# Altium project PCB_Project.PrjPCB
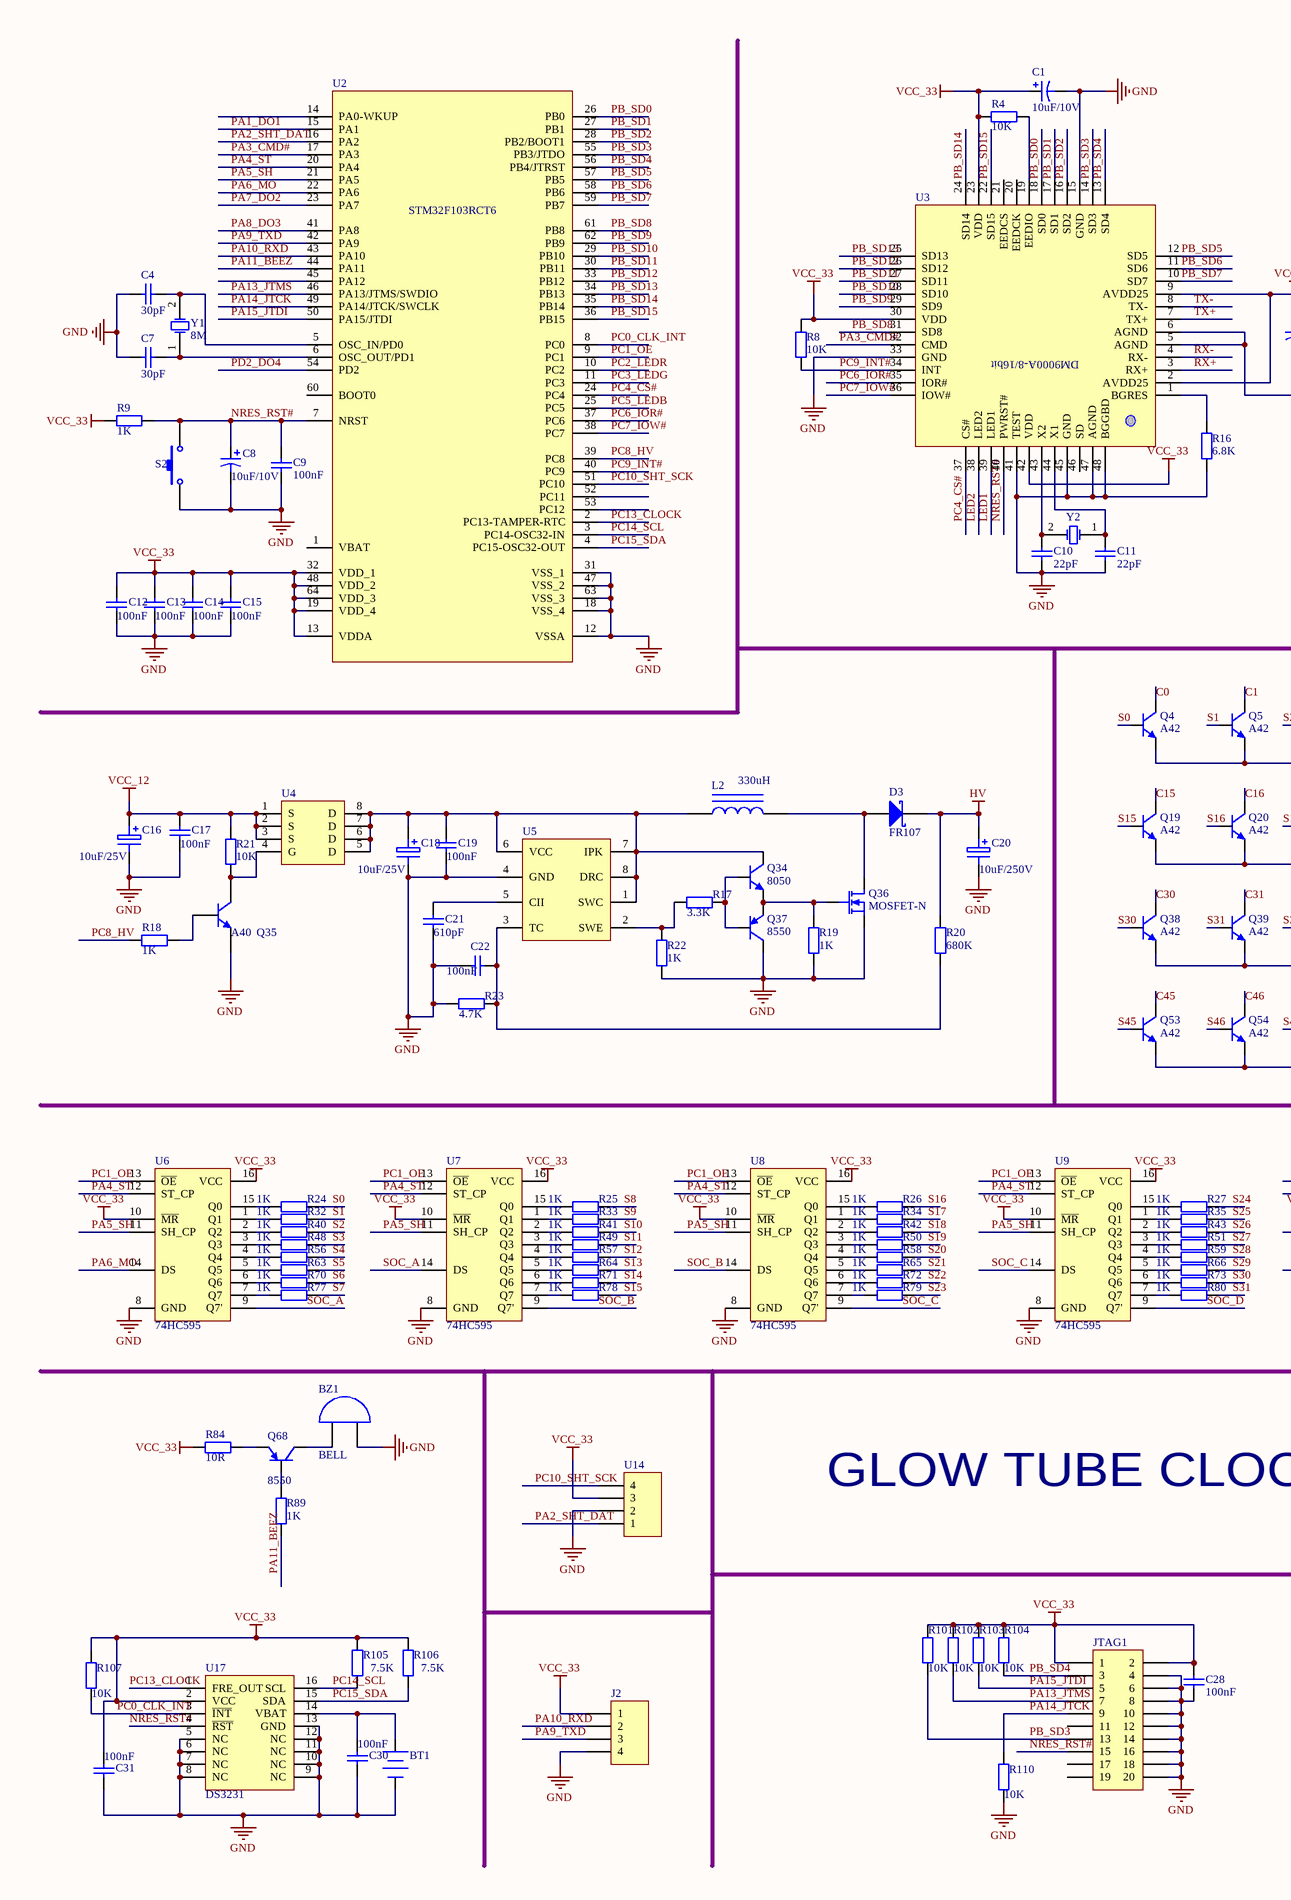
[diagram p0: Sheet.SchDoc, left]
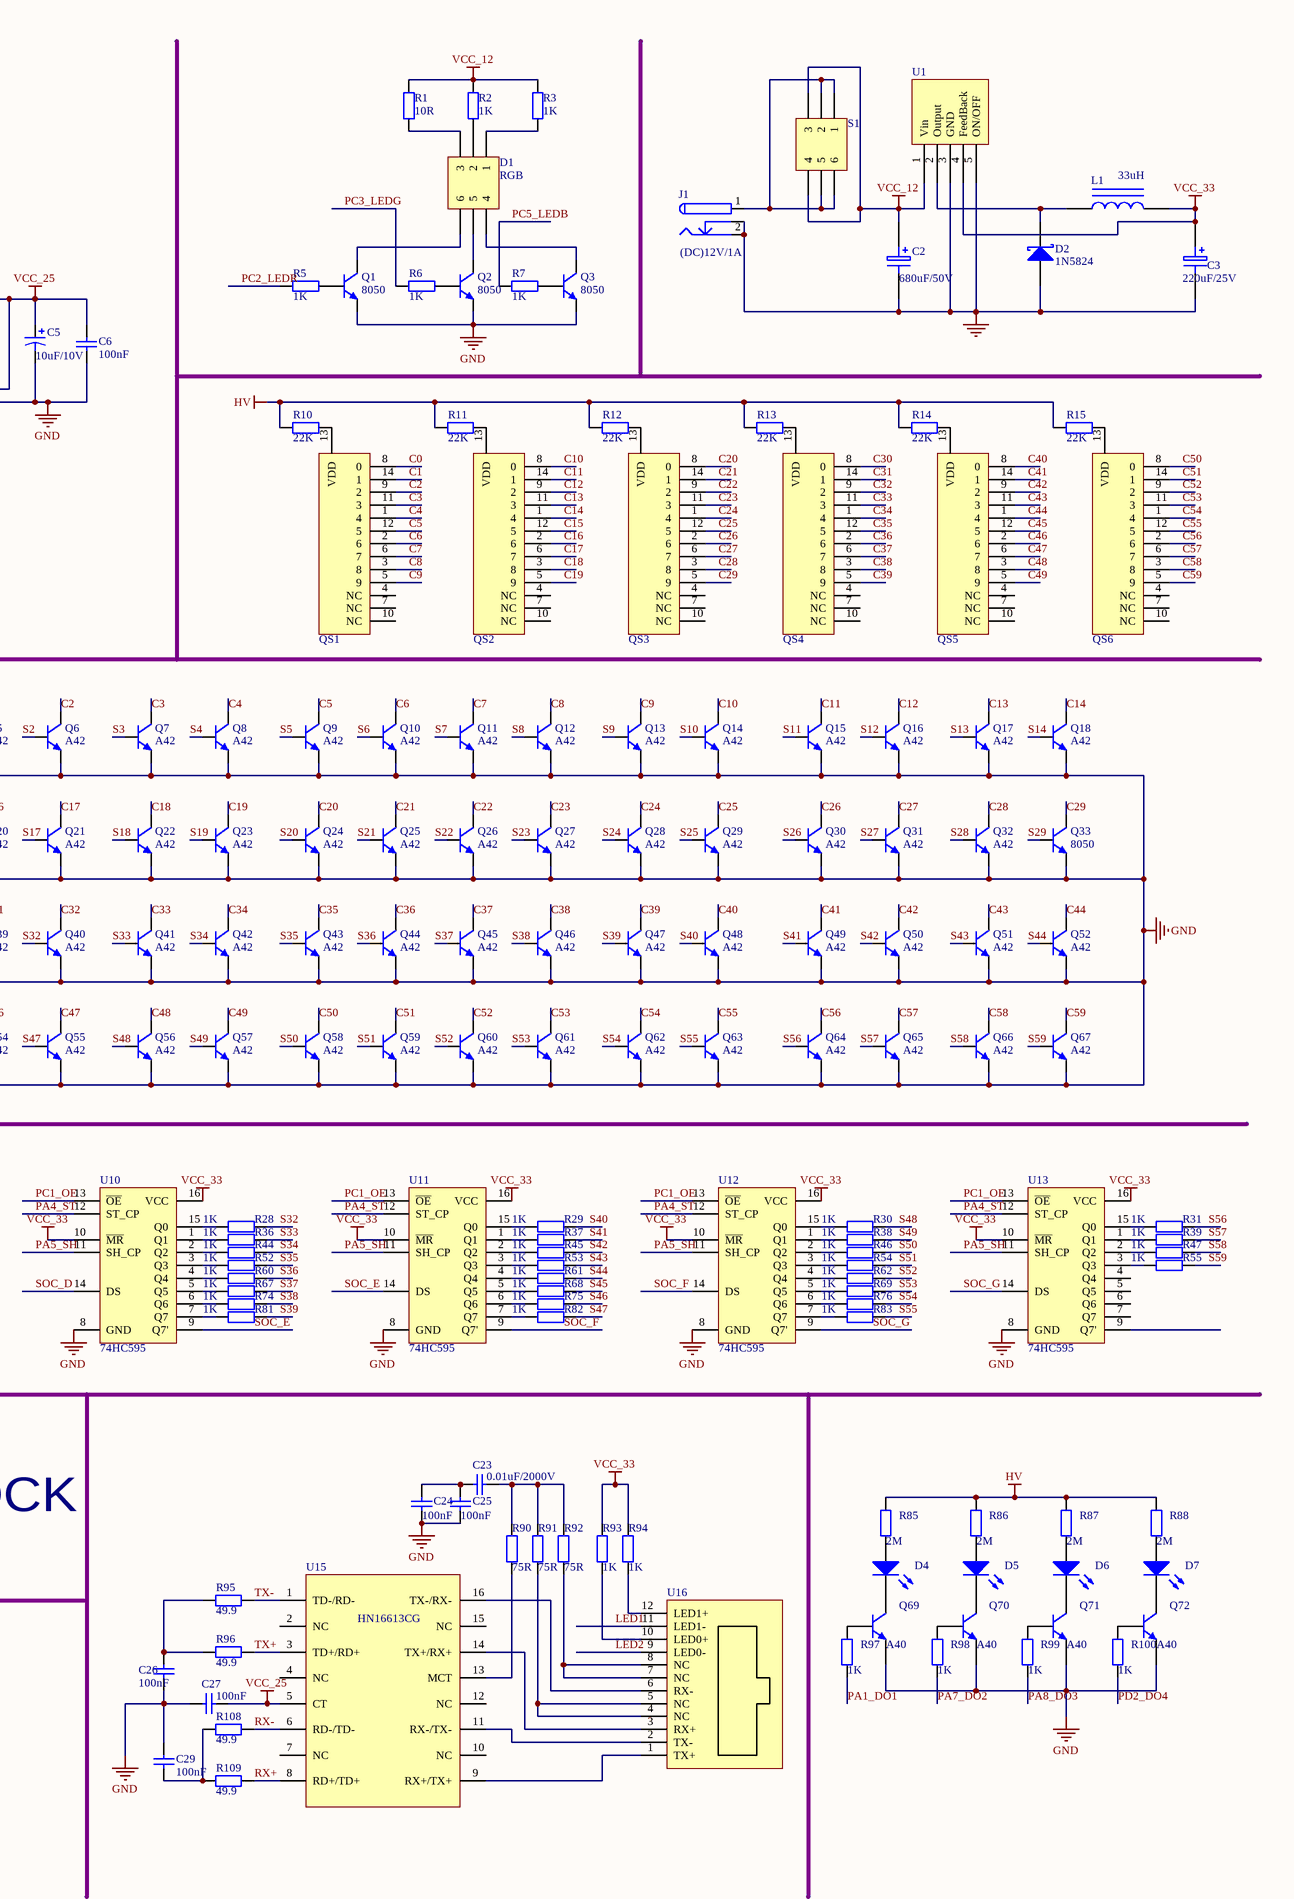
[diagram p1: Sheet.SchDoc, right]
1 sheet, 254 parts. Net scope: global (net labels, ports and power ports of the same name join across sheets).
Board file: PCB.PcbDoc

## Sheet Sheet.SchDoc
size C; PageSetup: Record=PageOptions?CenterHorizontal=True?CenterVertical=True?PrintScale=0.52?XCorrection=1.00?YCorrection=1.00?PrintKind=2?BorderSize=5000000?LeftOffset=0?BottomOffset=0?Orientation=2?PaperLength=1000?PaperWidth=1000?Scale=100?PaperSource=7?PrintQuality=-4?MediaType=1?DitherType=10?PaperKind=A4?PrintScaleMode=0

### Parts
BT1  Battery  [CR1220]  (value not drawn)
BZ1  BELL  [BEEZ]
C1  value 10uF/10V  [SMT_CAP_DAN]  (hidden comment: Cap Pol1)
C2  680uF/50V  [470/50V]
C3  220uF/25V  [330/25V]
C4  value 30pF  [SMT0805]  (hidden comment: Cap)
C5  value 10uF/10V  [SMT_CAP_DAN]  (hidden comment: Cap Pol1)
C6  value 100nF  [SMT0805]  (hidden comment: Cap)
C7  value 30pF  [SMT0805]  (hidden comment: Cap)
C8  value 10uF/10V  [SMT_CAP_DAN]  (hidden comment: Cap Pol1)
C9  value 100nF  [SMT0805]  (hidden comment: Cap)
C10  value 22pF  [SMT0805]  (hidden comment: Cap)
C11  value 22pF  [SMT0805]  (hidden comment: Cap)
C12  value 100nF  [SMT0805]  (hidden comment: Cap)
C13  value 100nF  [SMT0805]  (hidden comment: Cap)
C14  value 100nF  [SMT0805]  (hidden comment: Cap)
C15  value 100nF  [SMT0805]  (hidden comment: Cap)
C16  10uF/25V  [SMT_CAP_DAN]
C17  value 100nF  [SMT0805]  (hidden comment: Cap)
C18  10uF/25V  [SMT_CAP_DAN]
C19  value 100nF  [SMT0805]  (hidden comment: Cap)
C20  10uF/250V  [470/50V]
C21  value 610pF  [SMT0805]  (hidden comment: Cap)
C22  value 100nF  [SMT0805]  (hidden comment: Cap)
C23  value 0.01uF/2000V  [RAD-0.2]  (hidden comment: Cap)
C24  value 100nF  [SMT0805]  (hidden comment: Cap)
C25  value 100nF  [SMT0805]  (hidden comment: Cap)
C26  value 100nF  [SMT0805]  (hidden comment: Cap)
C27  value 100nF  [SMT0805]  (hidden comment: Cap)
C28  value 100nF  [SMT0805]  (hidden comment: Cap Semi)
C29  value 100nF  [SMT0805]  (hidden comment: Cap)
C30  value 100nF  [SMT0805]  (hidden comment: Cap Semi)
C31  value 100nF  [SMT0805]  (hidden comment: Cap Semi)
D1  RGB  [LED-RGB]
D2  1N5824  [FR107]
D3  FR107  [FR107]
D4  LED0  [DO]  (value not drawn)
D5  LED0  [DO]  (value not drawn)
D6  LED0  [DO]  (value not drawn)
D7  LED0  [DO]  (value not drawn)
J1  PWR2.5  [DC]  (value not drawn)
J2  Header 4  [HEAD_DIP4]  (value not drawn)
JTAG1  Header 10X2H  [HDR2X10]  (value not drawn)
L1  33uH  [L]
L2  330uH  [L]
Q1  8050  [SOP-23]
Q2  8050  [SOP-23]
Q3  8050  [SOP-23]
Q4  A42  [SOP-23]
Q5  A42  [SOP-23]
Q6  A42  [SOP-23]
Q7  A42  [SOP-23]
Q8  A42  [SOP-23]
Q9  A42  [SOP-23]
Q10  A42  [SOP-23]
Q11  A42  [SOP-23]
Q12  A42  [SOP-23]
Q13  A42  [SOP-23]
Q14  A42  [SOP-23]
Q15  A42  [SOP-23]
Q16  A42  [SOP-23]
Q17  A42  [SOP-23]
Q18  A42  [SOP-23]
Q19  A42  [SOP-23]
Q20  A42  [SOP-23]
Q21  A42  [SOP-23]
Q22  A42  [SOP-23]
Q23  A42  [SOP-23]
Q24  A42  [SOP-23]
Q25  A42  [SOP-23]
Q26  A42  [SOP-23]
Q27  A42  [SOP-23]
Q28  A42  [SOP-23]
Q29  A42  [SOP-23]
Q30  A42  [SOP-23]
Q31  A42  [SOP-23]
Q32  A42  [SOP-23]
Q33  8050  [SOP-23]
Q34  8050  [SOP-23]
Q35  A40  [SOP-23]
Q36  MOSFET-N  [TO-220]
Q37  8550  [SOP-23]
Q38  A42  [SOP-23]
Q39  A42  [SOP-23]
Q40  A42  [SOP-23]
Q41  A42  [SOP-23]
Q42  A42  [SOP-23]
Q43  A42  [SOP-23]
Q44  A42  [SOP-23]
Q45  A42  [SOP-23]
Q46  A42  [SOP-23]
Q47  A42  [SOP-23]
Q48  A42  [SOP-23]
Q49  A42  [SOP-23]
Q50  A42  [SOP-23]
Q51  A42  [SOP-23]
Q52  A42  [SOP-23]
Q53  A42  [SOP-23]
Q54  A42  [SOP-23]
Q55  A42  [SOP-23]
Q56  A42  [SOP-23]
Q57  A42  [SOP-23]
Q58  A42  [SOP-23]
Q59  A42  [SOP-23]
Q60  A42  [SOP-23]
Q61  A42  [SOP-23]
Q62  A42  [SOP-23]
Q63  A42  [SOP-23]
Q64  A42  [SOP-23]
Q65  A42  [SOP-23]
Q66  A42  [SOP-23]
Q67  A42  [SOP-23]
Q68  8550  [SOP-23]
Q69  A40  [SOP-23]
Q70  A40  [SOP-23]
Q71  A40  [SOP-23]
Q72  A40  [SOP-23]
QS1  IN-4  [IN-4]  (value not drawn)
QS2  IN-4  [IN-4]  (value not drawn)
QS3  IN-4  [IN-4]  (value not drawn)
QS4  IN-4  [IN-4]  (value not drawn)
QS5  IN-4  [IN-4]  (value not drawn)
QS6  IN-4  [IN-4]  (value not drawn)
R1  value 10R  [SMT0805]  (hidden comment: Res2)
R2  value 1K  [SMT0805]  (hidden comment: Res2)
R3  value 1K  [SMT0805]  (hidden comment: Res2)
R4  value 10K  [SMT0805]  (hidden comment: Res2)
R5  value 1K  [SMT0805]  (hidden comment: Res2)
R6  value 1K  [SMT0805]  (hidden comment: Res2)
R7  value 1K  [SMT0805]  (hidden comment: Res2)
R8  value 10K  [SMT0805]  (hidden comment: Res2)
R9  value 1K  [SMT0805]  (hidden comment: Res2)
R10  value 22K  [SMT0805]  (hidden comment: Res2)
R11  value 22K  [SMT0805]  (hidden comment: Res2)
R12  value 22K  [SMT0805]  (hidden comment: Res2)
R13  value 22K  [SMT0805]  (hidden comment: Res2)
R14  value 22K  [SMT0805]  (hidden comment: Res2)
R15  value 22K  [SMT0805]  (hidden comment: Res2)
R16  value 6.8K  [SMT0805]  (hidden comment: Res2)
R17  value 3.3K  [SMT0805]  (hidden comment: Res2)
R18  value 1K  [SMT0805]  (hidden comment: Res2)
R19  value 1K  [SMT0805]  (hidden comment: Res2)
R20  value 680K  [SMT0805]  (hidden comment: Res2)
R21  value 10K  [SMT0805]  (hidden comment: Res2)
R22  value 1K  [SMT0805]  (hidden comment: Res2)
R23  value 4.7K  [SMT0805]  (hidden comment: Res2)
R24  value 1K  [SMT0805]  (hidden comment: Res2)
R25  value 1K  [SMT0805]  (hidden comment: Res2)
R26  value 1K  [SMT0805]  (hidden comment: Res2)
R27  value 1K  [SMT0805]  (hidden comment: Res2)
R28  value 1K  [SMT0805]  (hidden comment: Res2)
R29  value 1K  [SMT0805]  (hidden comment: Res2)
R30  value 1K  [SMT0805]  (hidden comment: Res2)
R31  value 1K  [SMT0805]  (hidden comment: Res2)
R32  value 1K  [SMT0805]  (hidden comment: Res2)
R33  value 1K  [SMT0805]  (hidden comment: Res2)
R34  value 1K  [SMT0805]  (hidden comment: Res2)
R35  value 1K  [SMT0805]  (hidden comment: Res2)
R36  value 1K  [SMT0805]  (hidden comment: Res2)
R37  value 1K  [SMT0805]  (hidden comment: Res2)
R38  value 1K  [SMT0805]  (hidden comment: Res2)
R39  value 1K  [SMT0805]  (hidden comment: Res2)
R40  value 1K  [SMT0805]  (hidden comment: Res2)
R41  value 1K  [SMT0805]  (hidden comment: Res2)
R42  value 1K  [SMT0805]  (hidden comment: Res2)
R43  value 1K  [SMT0805]  (hidden comment: Res2)
R44  value 1K  [SMT0805]  (hidden comment: Res2)
R45  value 1K  [SMT0805]  (hidden comment: Res2)
R46  value 1K  [SMT0805]  (hidden comment: Res2)
R47  value 1K  [SMT0805]  (hidden comment: Res2)
R48  value 1K  [SMT0805]  (hidden comment: Res2)
R49  value 1K  [SMT0805]  (hidden comment: Res2)
R50  value 1K  [SMT0805]  (hidden comment: Res2)
R51  value 1K  [SMT0805]  (hidden comment: Res2)
R52  value 1K  [SMT0805]  (hidden comment: Res2)
R53  value 1K  [SMT0805]  (hidden comment: Res2)
R54  value 1K  [SMT0805]  (hidden comment: Res2)
R55  value 1K  [SMT0805]  (hidden comment: Res2)
R56  value 1K  [SMT0805]  (hidden comment: Res2)
R57  value 1K  [SMT0805]  (hidden comment: Res2)
R58  value 1K  [SMT0805]  (hidden comment: Res2)
R59  value 1K  [SMT0805]  (hidden comment: Res2)
R60  value 1K  [SMT0805]  (hidden comment: Res2)
R61  value 1K  [SMT0805]  (hidden comment: Res2)
R62  value 1K  [SMT0805]  (hidden comment: Res2)
R63  value 1K  [SMT0805]  (hidden comment: Res2)
R64  value 1K  [SMT0805]  (hidden comment: Res2)
R65  value 1K  [SMT0805]  (hidden comment: Res2)
R66  value 1K  [SMT0805]  (hidden comment: Res2)
R67  value 1K  [SMT0805]  (hidden comment: Res2)
R68  value 1K  [SMT0805]  (hidden comment: Res2)
R69  value 1K  [SMT0805]  (hidden comment: Res2)
R70  value 1K  [SMT0805]  (hidden comment: Res2)
R71  value 1K  [SMT0805]  (hidden comment: Res2)
R72  value 1K  [SMT0805]  (hidden comment: Res2)
R73  value 1K  [SMT0805]  (hidden comment: Res2)
R74  value 1K  [SMT0805]  (hidden comment: Res2)
R75  value 1K  [SMT0805]  (hidden comment: Res2)
R76  value 1K  [SMT0805]  (hidden comment: Res2)
R77  value 1K  [SMT0805]  (hidden comment: Res2)
R78  value 1K  [SMT0805]  (hidden comment: Res2)
R79  value 1K  [SMT0805]  (hidden comment: Res2)
R80  value 1K  [SMT0805]  (hidden comment: Res2)
R81  value 1K  [SMT0805]  (hidden comment: Res2)
R82  value 1K  [SMT0805]  (hidden comment: Res2)
R83  value 1K  [SMT0805]  (hidden comment: Res2)
R84  value 10R  [SMT0805]  (hidden comment: Res2)
R85  value 2M  [SMT0805]  (hidden comment: Res2)
R86  value 2M  [SMT0805]  (hidden comment: Res2)
R87  value 2M  [SMT0805]  (hidden comment: Res2)
R88  value 2M  [SMT0805]  (hidden comment: Res2)
R89  value 1K  [SMT0805]  (hidden comment: Res2)
R90  value 75R  [SMT0805]  (hidden comment: Res2)
R91  value 75R  [SMT0805]  (hidden comment: Res2)
R92  value 75R  [SMT0805]  (hidden comment: Res2)
R93  value 1K  [SMT0805]  (hidden comment: Res2)
R94  value 1K  [SMT0805]  (hidden comment: Res2)
R95  value 49.9  [SMT0805]  (hidden comment: Res2)
R96  value 49.9  [SMT0805]  (hidden comment: Res2)
R97  value 1K  [SMT0805]  (hidden comment: Res2)
R98  value 1K  [SMT0805]  (hidden comment: Res2)
R99  value 1K  [SMT0805]  (hidden comment: Res2)
R100  value 1K  [SMT0805]  (hidden comment: Res2)
R101  value 10K  [SMT0805]  (hidden comment: Res2)
R102  value 10K  [SMT0805]  (hidden comment: Res2)
R103  value 10K  [SMT0805]  (hidden comment: Res2)
R104  value 10K  [SMT0805]  (hidden comment: Res2)
R105  value 7.5K  [SMT0805]  (hidden comment: Res2)
R106  value 7.5K  [SMT0805]  (hidden comment: Res2)
R107  value 10K  [SMT0805]  (hidden comment: Res2)
R108  value 49.9  [SMT0805]  (hidden comment: Res2)
R109  value 49.9  [SMT0805]  (hidden comment: Res2)
R110  value 10K  [SMT0805]  (hidden comment: Res2)
S1  Header 3X2A  [LOCK_SW_DIP6]  (value not drawn)
S2  SW-PB  [KEY]  (value not drawn)
U1  *  [LM2575]  (value not drawn)
U2  STM32F103RCT6  [LQFP64]  (value not drawn)
U3  DM9000  [LQFP48]  (value not drawn)
U4  AO4423L  [SOP_8]  (value not drawn)
U5  MC34063  [SOP_8]  (value not drawn)
U6  74HC595  [SOT109-1]
U7  74HC595  [SOT109-1]
U8  74HC595  [SOT109-1]
U9  74HC595  [SOT109-1]
U10  74HC595  [SOT109-1]
U11  74HC595  [SOT109-1]
U12  74HC595  [SOT109-1]
U13  74HC595  [SOT109-1]
U14  Header 4  [HDR1X4]  (value not drawn)
U15  HN16613CG  [SOJ16-T]  (value not drawn)
U16  RJ-45  [RJ45-LED]  (value not drawn)
U17  DS3231  [DS3231]
Y1  8M  [XTAL_DIP]
Y2  25M  [XTAL_DIP]  (value not drawn)

### Nets
GND: BT1.2(-) BZ1.2(B) C1.2 C2.2 C3.2 C4.2 C5.2 C6.2 C7.2 C8.2 C9.2 C10.2 C11.2 C12.2 C13.2 C14.2 C15.2 C16.2 C17.2 C18.2 C19.2 C20.2 C21.2 C22.2 C24.2 C25.2 C26.2 C27.1 C28.1 C29.2 C30.1 C31.1 D2.1(A) J1.2 J1.3 J2.4 JTAG1.4 JTAG1.6 JTAG1.8 JTAG1.10 JTAG1.12 JTAG1.14 JTAG1.16 JTAG1.18 JTAG1.20 Q1.2(E) Q2.2(E) Q3.2(E) Q4.2(E) Q5.2(E) Q6.2(E) Q7.2(E) Q8.2(E) Q9.2(E) Q10.2(E) Q11.2(E) Q12.2(E) Q13.2(E) Q14.2(E) Q15.2(E) Q16.2(E) Q17.2(E) Q18.2(E) Q19.2(E) Q20.2(E) Q21.2(E) Q22.2(E) Q23.2(E) Q24.2(E) Q25.2(E) Q26.2(E) Q27.2(E) Q28.2(E) Q29.2(E) Q30.2(E) Q31.2(E) Q32.2(E) Q33.2(E) Q35.2(E) Q36.3(S) Q37.3(C) Q38.2(E) Q39.2(E) Q40.2(E) Q41.2(E) Q42.2(E) Q43.2(E) Q44.2(E) Q45.2(E) Q46.2(E) Q47.2(E) Q48.2(E) Q49.2(E) Q50.2(E) Q51.2(E) Q52.2(E) Q53.2(E) Q54.2(E) Q55.2(E) Q56.2(E) Q57.2(E) Q58.2(E) Q59.2(E) Q60.2(E) Q61.2(E) Q62.2(E) Q63.2(E) Q64.2(E) Q65.2(E) Q66.2(E) Q67.2(E) Q69.2(E) Q70.2(E) Q71.2(E) Q72.2(E) R16.2 R19.1 R22.1 R23.1 R110.1 S2.1 U1.3(GND) U1.5(ON/OFF) U2.12(VSSA) U2.18(VSS_4) U2.31(VSS_1) U2.47(VSS_2) U2.63(VSS_3) U3.5(AGND) U3.6(AGND) U3.15(GND) U3.33(GND) U3.41(TEST) U3.45(GND) U3.47(AGND) U3.48(BGGBD) U5.4(GND) U6.8(GND) U7.8(GND) U8.8(GND) U9.8(GND) U10.8(GND) U11.8(GND) U12.8(GND) U13.8(GND) U14.2 U17.5(NC) U17.6(NC) U17.7(NC) U17.8(NC) U17.9(NC) U17.10(NC) U17.11(NC) U17.12(NC) U17.13(GND)
HV: C20.1 D3.2(K) R10.2 R11.2 R12.2 R13.2 R14.2 R15.2 R20.2 R85.2 R86.2 R87.2 R88.2
VCC_12: C2.1 C16.1 C17.1 R1.1 R2.2 R3.1 R21.1 S1.3 S1.4 U1.1(Vin) U4.1(S) U4.2(S) U4.3(S)
VCC_25: C5.1 C6.1 C27.2 U3.2(AVDD25) U3.9(AVDD25) U15.5(CT)
VCC_33: C1.1 C3.1 C12.1 C13.1 C14.1 C15.1 C28.2 C31.2 J2.1 JTAG1.1 JTAG1.2 L1.2 R4.1 R8.1 R9.1 R84.1 R93.2 R94.2 R101.2 R102.1 R103.1 R104.2 R105.2 R106.2 R107.2 U1.4(FeedBack) U2.13(VDDA) U2.19(VDD_4) U2.32(VDD_1) U2.48(VDD_2) U2.64(VDD_3) U3.23(VDD) U3.30(VDD) U3.42(VDD) U6.10(~{MR}) U6.16(VCC) U7.10(~{MR}) U7.16(VCC) U8.10(~{MR}) U8.16(VCC) U9.10(~{MR}) U9.16(VCC) U10.10(~{MR}) U10.16(VCC) U11.10(~{MR}) U11.16(VCC) U12.10(~{MR}) U12.16(VCC) U13.10(~{MR}) U13.16(VCC) U14.3 U17.2(VCC)
C0: Q4.3(C) QS1.8(0)
C1: Q5.3(C) QS1.14(1)
C2: Q6.3(C) QS1.9(2)
C3: Q7.3(C) QS1.11(3)
C4: Q8.3(C) QS1.1(4)
C5: Q9.3(C) QS1.12(5)
C6: Q10.3(C) QS1.2(6)
C7: Q11.3(C) QS1.6(7)
C8: Q12.3(C) QS1.3(8)
C9: Q13.3(C) QS1.5(9)
C10: Q14.3(C) QS2.8(0)
C11: Q15.3(C) QS2.14(1)
C12: Q16.3(C) QS2.9(2)
C13: Q17.3(C) QS2.11(3)
C14: Q18.3(C) QS2.1(4)
C15: Q19.3(C) QS2.12(5)
C16: Q20.3(C) QS2.2(6)
C17: Q21.3(C) QS2.6(7)
C18: Q22.3(C) QS2.3(8)
C19: Q23.3(C) QS2.5(9)
C20: Q24.3(C) QS3.8(0)
C21: Q25.3(C) QS3.14(1)
C22: Q26.3(C) QS3.9(2)
C23: Q27.3(C) QS3.11(3)
C24: Q28.3(C) QS3.1(4)
C25: Q29.3(C) QS3.12(5)
C26: Q30.3(C) QS3.2(6)
C27: Q31.3(C) QS3.6(7)
C28: Q32.3(C) QS3.3(8)
C29: Q33.3(C) QS3.5(9)
C30: Q38.3(C) QS4.8(0)
C31: Q39.3(C) QS4.14(1)
C32: Q40.3(C) QS4.9(2)
C33: Q41.3(C) QS4.11(3)
C34: Q42.3(C) QS4.1(4)
C35: Q43.3(C) QS4.12(5)
C36: Q44.3(C) QS4.2(6)
C37: Q45.3(C) QS4.6(7)
C38: Q46.3(C) QS4.3(8)
C39: Q47.3(C) QS4.5(9)
C40: Q48.3(C) QS5.8(0)
C41: Q49.3(C) QS5.14(1)
C42: Q50.3(C) QS5.9(2)
C43: Q51.3(C) QS5.11(3)
C44: Q52.3(C) QS5.1(4)
C45: Q53.3(C) QS5.12(5)
C46: Q54.3(C) QS5.2(6)
C47: Q55.3(C) QS5.6(7)
C48: Q56.3(C) QS5.3(8)
C49: Q57.3(C) QS5.5(9)
C50: Q58.3(C) QS6.8(0)
C51: Q59.3(C) QS6.14(1)
C52: Q60.3(C) QS6.9(2)
C53: Q61.3(C) QS6.11(3)
C54: Q62.3(C) QS6.1(4)
C55: Q63.3(C) QS6.12(5)
C56: Q64.3(C) QS6.2(6)
C57: Q65.3(C) QS6.6(7)
C58: Q66.3(C) QS6.3(8)
C59: Q67.3(C) QS6.5(9)
LED1: U3.39(LED1) U16.11(LED1-)
LED2: U3.38(LED2) U16.9(LED0-)
NRES_RST#: C8.1 C9.1 JTAG1.15 R9.2 S2.2 U2.7(NRST) U3.40(PWRST#) U17.4(~{RST})
PA1_DO1: R97.1 U2.15(PA1)
PA2_SHT_DAT: U2.16(PA2) U14.1
PA3_CMD#: U2.17(PA3) U3.32(CMD)
PA4_ST: U2.20(PA4) U6.12(ST_CP) U7.12(ST_CP) U8.12(ST_CP) U9.12(ST_CP) U10.12(ST_CP) U11.12(ST_CP) U12.12(ST_CP) U13.12(ST_CP)
PA5_SH: U2.21(PA5) U6.11(SH_CP) U7.11(SH_CP) U8.11(SH_CP) U9.11(SH_CP) U10.11(SH_CP) U11.11(SH_CP) U12.11(SH_CP) U13.11(SH_CP)
PA6_MO: U2.22(PA6) U6.14(DS)
PA7_DO2: R98.1 U2.23(PA7)
PA8_DO3: R99.1 U2.41(PA8)
PA9_TXD: J2.3 U2.42(PA9)
PA10_RXD: J2.2 U2.43(PA10)
PA11_BEEZ: R89.2 U2.44(PA11)
PA13_JTMS: JTAG1.7 R102.2 U2.46(PA13/JTMS/SWDIO)
PA14_JTCK: JTAG1.9 R110.2 U2.49(PA14/JTCK/SWCLK)
PA15_JTDI: JTAG1.5 R103.2 U2.50(PA15/JTDI)
PB_SD0: U2.26(PB0) U3.18(SD0)
PB_SD1: U2.27(PB1) U3.17(SD1)
PB_SD2: U2.28(PB2/BOOT1) U3.16(SD2)
PB_SD3: JTAG1.13 R101.1 U2.55(PB3/JTDO) U3.14(SD3)
PB_SD4: JTAG1.3 R104.1 U2.56(PB4/JTRST) U3.13(SD4)
PB_SD5: U2.57(PB5) U3.12(SD5)
PB_SD6: U2.58(PB6) U3.11(SD6)
PB_SD7: U2.59(PB7) U3.10(SD7)
PB_SD8: U2.61(PB8) U3.31(SD8)
PB_SD9: U2.62(PB9) U3.29(SD9)
PB_SD10: U2.29(PB10) U3.28(SD10)
PB_SD11: U2.30(PB11) U3.27(SD11)
PB_SD12: U2.33(PB12) U3.26(SD12)
PB_SD13: U2.34(PB13) U3.25(SD13)
PB_SD14: U2.35(PB14) U3.24(SD14)
PB_SD15: U2.36(PB15) U3.22(SD15)
PC0_CLK_INT: R107.1 U2.8(PC0) U17.3(~{INT})
PC1_OE: U2.9(PC1) U6.13(~{OE}) U7.13(~{OE}) U8.13(~{OE}) U9.13(~{OE}) U10.13(~{OE}) U11.13(~{OE}) U12.13(~{OE}) U13.13(~{OE})
PC2_LEDR: R5.2 U2.10(PC2)
PC3_LEDG: R6.2 U2.11(PC3)
PC4_CS#: U2.24(PC4) U3.37(CS#)
PC5_LEDB: R7.2 U2.25(PC5)
PC6_IOR#: U2.37(PC6) U3.35(IOR#)
PC7_IOW#: U2.38(PC7) U3.36(IOW#)
PC8_HV: R18.1 U2.39(PC8)
PC9_INT#: R8.2 U2.40(PC9) U3.34(INT)
PC10_SHT_SCK: U2.51(PC10) U14.4
PC13_CLOCK: U2.2(PC13-TAMPER-RTC) U17.1(FRE_OUT)
PC14_SCL: R105.1 U2.3(PC14-OSC32-IN) U17.16(SCL)
PC15_SDA: R106.1 U2.4(PC15-OSC32-OUT) U17.15(SDA)
PD2_DO4: R100.1 U2.54(PD2)
RX+: R109.2 U3.3(RX+) U15.8(RD+/TD+)
RX-: R108.2 U3.4(RX-) U15.6(RD-/TD-)
S0: Q4.1(B) R24.1
S1: Q5.1(B) R32.1
S2: Q6.1(B) R40.1
S3: Q7.1(B) R48.1
S4: Q8.1(B) R56.1
S5: Q9.1(B) R63.1
S6: Q10.1(B) R70.1
S7: Q11.1(B) R77.1
S8: Q12.1(B) R25.1
S9: Q13.1(B) R33.1
S10: Q14.1(B) R41.1
S11: Q15.1(B) R49.1
S12: Q16.1(B) R57.1
S13: Q17.1(B) R64.1
S14: Q18.1(B) R71.1
S15: Q19.1(B) R78.1
S16: Q20.1(B) R26.1
S17: Q21.1(B) R34.1
S18: Q22.1(B) R42.1
S19: Q23.1(B) R50.1
S20: Q24.1(B) R58.1
S21: Q25.1(B) R65.1
S22: Q26.1(B) R72.1
S23: Q27.1(B) R79.1
S24: Q28.1(B) R27.1
S25: Q29.1(B) R35.1
S26: Q30.1(B) R43.1
S27: Q31.1(B) R51.1
S28: Q32.1(B) R59.1
S29: Q33.1(B) R66.1
S30: Q38.1(B) R73.1
S31: Q39.1(B) R80.1
S32: Q40.1(B) R28.1
S33: Q41.1(B) R36.1
S34: Q42.1(B) R44.1
S35: Q43.1(B) R52.1
S36: Q44.1(B) R60.1
S37: Q45.1(B) R67.1
S38: Q46.1(B) R74.1
S39: Q47.1(B) R81.1
S40: Q48.1(B) R29.1
S41: Q49.1(B) R37.1
S42: Q50.1(B) R45.1
S43: Q51.1(B) R53.1
S44: Q52.1(B) R61.1
S45: Q53.1(B) R68.1
S46: Q54.1(B) R75.1
S47: Q55.1(B) R82.1
S48: Q56.1(B) R30.1
S49: Q57.1(B) R38.1
S50: Q58.1(B) R46.1
S51: Q59.1(B) R54.1
S52: Q60.1(B) R62.1
S53: Q61.1(B) R69.1
S54: Q62.1(B) R76.1
S55: Q63.1(B) R83.1
S56: Q64.1(B) R31.1
S57: Q65.1(B) R39.1
S58: Q66.1(B) R47.1
S59: Q67.1(B) R55.1
SOC_A: U6.9(Q7') U7.14(DS)
SOC_B: U7.9(Q7') U8.14(DS)
SOC_C: U8.9(Q7') U9.14(DS)
SOC_D: U9.9(Q7') U10.14(DS)
SOC_E: U10.9(Q7') U11.14(DS)
SOC_F: U11.9(Q7') U12.14(DS)
SOC_G: U12.9(Q7') U13.14(DS)
TX+: R96.2 U3.7(TX+) U15.3(TD+/RD+)
TX-: R95.2 U3.8(TX-) U15.1(TD-/RD-)
NetBT1_1: BT1.1(+) C30.2 U17.14(VBAT)
NetBZ1_1: BZ1.1(A) Q68.3(C)
NetC4_1: C4.1 U2.5(OSC_IN/PD0) Y1.2(OSC2)
NetC7_1: C7.1 U2.6(OSC_OUT/PD1) Y1.1(OSC1)
NetC10_1: C10.1 U3.43(X2) Y2.2(OSC2)
NetC11_1: C11.1 U3.44(X1) Y2.1(OSC1)
NetC18_1: C18.1 C19.1 L2.1 Q34.3(C) U4.5(D) U4.6(D) U4.7(D) U4.8(D) U5.1(SWC) U5.6(VCC) U5.7(IPK) U5.8(DRC)
NetC21_1: C21.1 U5.5(CII)
NetC22_1: C22.1 R20.1 R23.2 U5.3(TC)
NetC23_1: C23.1 C24.1 C25.1
NetC23_2: C23.2 R90.2 R91.2 R92.2
NetC26_1: C26.1 R95.1 R96.1
NetC29_1: C29.1 R108.1 R109.1
NetD1_1: D1.1 R3.2
NetD1_2: D1.2 R2.1
NetD1_3: D1.3 R1.2
NetD1_4: D1.4 Q3.3(C)
NetD1_5: D1.5 Q2.3(C)
NetD1_6: D1.6 Q1.3(C)
NetD2_2: D2.2(K) L1.1 U1.2(Output)
NetD3_1: D3.1(A) L2.2 Q36.2(D)
NetD4_1: D4.1(A) R85.1
NetD4_2: D4.2(K) Q69.3(C)
NetD5_1: D5.1(A) R86.1
NetD5_2: D5.2(K) Q70.3(C)
NetD6_1: D6.1(A) R87.1
NetD6_2: D6.2(K) Q71.3(C)
NetD7_1: D7.1(A) R88.1
NetD7_2: D7.2(K) Q72.3(C)
NetJ1_1: J1.1 S1.1 S1.2 S1.5 S1.6
NetQ1_1: Q1.1(B) R5.1
NetQ2_1: Q2.1(B) R6.1
NetQ3_1: Q3.1(B) R7.1
NetQ34_1: Q34.1(B) Q37.1(B) R17.2
NetQ34_2: Q34.2(E) Q36.1(G) Q37.2(E) R19.2
NetQ35_1: Q35.1(B) R18.2
NetQ35_3: Q35.3(C) R21.2 U4.4(G)
NetQ68_1: Q68.1(B) R89.1
NetQ68_2: Q68.2(E) R84.2
NetQ69_1: Q69.1(B) R97.2
NetQ70_1: Q70.1(B) R98.2
NetQ71_1: Q71.1(B) R99.2
NetQ72_1: Q72.1(B) R100.2
NetQS1_13: QS1.13(VDD) R10.1
NetQS2_13: QS2.13(VDD) R11.1
NetQS3_13: QS3.13(VDD) R12.1
NetQS4_13: QS4.13(VDD) R13.1
NetQS5_13: QS5.13(VDD) R14.1
NetQS6_13: QS6.13(VDD) R15.1
NetR4_2: R4.2 U3.19(EEDIO)
NetR16_1: R16.1 U3.1(BGRES)
NetR17_1: R17.1 R22.2 U5.2(SWE)
NetR24_2: R24.2 U6.15(Q0)
NetR25_2: R25.2 U7.15(Q0)
NetR26_2: R26.2 U8.15(Q0)
NetR27_2: R27.2 U9.15(Q0)
NetR28_2: R28.2 U10.15(Q0)
NetR29_2: R29.2 U11.15(Q0)
NetR30_2: R30.2 U12.15(Q0)
NetR31_2: R31.2 U13.15(Q0)
NetR32_2: R32.2 U6.1(Q1)
NetR33_2: R33.2 U7.1(Q1)
NetR34_2: R34.2 U8.1(Q1)
NetR35_2: R35.2 U9.1(Q1)
NetR36_2: R36.2 U10.1(Q1)
NetR37_2: R37.2 U11.1(Q1)
NetR38_2: R38.2 U12.1(Q1)
NetR39_2: R39.2 U13.1(Q1)
NetR40_2: R40.2 U6.2(Q2)
NetR41_2: R41.2 U7.2(Q2)
NetR42_2: R42.2 U8.2(Q2)
NetR43_2: R43.2 U9.2(Q2)
NetR44_2: R44.2 U10.2(Q2)
NetR45_2: R45.2 U11.2(Q2)
NetR46_2: R46.2 U12.2(Q2)
NetR47_2: R47.2 U13.2(Q2)
NetR48_2: R48.2 U6.3(Q3)
NetR49_2: R49.2 U7.3(Q3)
NetR50_2: R50.2 U8.3(Q3)
NetR51_2: R51.2 U9.3(Q3)
NetR52_2: R52.2 U10.3(Q3)
NetR53_2: R53.2 U11.3(Q3)
NetR54_2: R54.2 U12.3(Q3)
NetR55_2: R55.2 U13.3(Q3)
NetR56_2: R56.2 U6.4(Q4)
NetR57_2: R57.2 U7.4(Q4)
NetR58_2: R58.2 U8.4(Q4)
NetR59_2: R59.2 U9.4(Q4)
NetR60_2: R60.2 U10.4(Q4)
NetR61_2: R61.2 U11.4(Q4)
NetR62_2: R62.2 U12.4(Q4)
NetR63_2: R63.2 U6.5(Q5)
NetR64_2: R64.2 U7.5(Q5)
NetR65_2: R65.2 U8.5(Q5)
NetR66_2: R66.2 U9.5(Q5)
NetR67_2: R67.2 U10.5(Q5)
NetR68_2: R68.2 U11.5(Q5)
NetR69_2: R69.2 U12.5(Q5)
NetR70_2: R70.2 U6.6(Q6)
NetR71_2: R71.2 U7.6(Q6)
NetR72_2: R72.2 U8.6(Q6)
NetR73_2: R73.2 U9.6(Q6)
NetR74_2: R74.2 U10.6(Q6)
NetR75_2: R75.2 U11.6(Q6)
NetR76_2: R76.2 U12.6(Q6)
NetR77_2: R77.2 U6.7(Q7)
NetR78_2: R78.2 U7.7(Q7)
NetR79_2: R79.2 U8.7(Q7)
NetR80_2: R80.2 U9.7(Q7)
NetR81_2: R81.2 U10.7(Q7)
NetR82_2: R82.2 U11.7(Q7)
NetR83_2: R83.2 U12.7(Q7)
NetR90_1: R90.1 U15.13(MCT)
NetR91_1: R91.1 U16.4(NC) U16.5(NC)
NetR92_1: R92.1 U16.7(NC) U16.8(NC)
NetR93_1: R93.1 U16.10(LED0+)
NetR94_1: R94.1 U16.12(LED1+)
NetU15_9: U15.9(RX+/TX+) U16.1(TX+)
NetU15_11: U15.11(RX-/TX-) U16.2(TX-)
NetU15_14: U15.14(TX+/RX+) U16.3(RX+)
NetU15_16: U15.16(TX-/RX-) U16.6(RX-)

Not connected (* = marked no-connect by the designer): JTAG1 11 17 19; QS1 4(NC) 7(NC) 10(NC); QS2 4(NC) 7(NC) 10(NC); QS3 4(NC) 7(NC) 10(NC); QS4 4(NC) 7(NC) 10(NC); QS5 4(NC) 7(NC) 10(NC); QS6 4(NC) 7(NC) 10(NC); U2 1(VBAT) 14(PA0-WKUP) 45(PA12) 52(PC11) 53(PC12) 60(BOOT0); U3 20(EEDCK) 21(EEDCS) 46(SD); U13 4(Q4) 5(Q5) 6(Q6) 7(Q7) 9(Q7'); U15 2(NC) 4(NC) 7(NC) 10(NC) 12(NC) 15(NC)

### Notes on the sheet
- (near J1) (DC)12V/1A
- GLOW TUBE CLOCK
- (in symbol DM9000) DM9000A-8/16bit

### Library data of the parts
BT1 = Battery: Multicell Battery; Published: 24-Mar-1999; LatestRevisionDate: 17-Jul-2002; LatestRevisionNote: Re-released for DXP Platform.; PackageReference: BAT-2; Publisher: Altium Limited; PackageDescription: Battery; 2 Leads
C1 C5 C8 = Cap Pol1: Polarized Capacitor (Radial); Published: 8-Jun-2000; LatestRevisionDate: 17-Jul-2002; LatestRevisionNote: Re-released for DXP Platform.; PackageReference: RB7.6-15; Publisher: Altium Limited
C2 C3 C16 C18 C20 = ELECTRO1: Electrolytic Capacitor
C4 C6 C7 C9-C15 C17 C19 C21-C27 C29 = Cap: Capacitor; Published: 8-Jun-2000; LatestRevisionDate: 17-Jul-2002; LatestRevisionNote: Re-released for DXP Platform.; PackageReference: RAD-0.3; Publisher: Altium Limited
C28 C30 C31 = Cap Semi: Capacitor (Semiconductor SIM Model); Published: 8-Jun-2000; LatestRevisionDate: 29-May-2009; LatestRevisionNote: IPC-7351 Footprint Added.; PackageReference: C1206; Publisher: Altium Limited; PackageDescription: Chip Capacitor
D1 S1 = Header 3X2A: Header, 3-Pin, Dual row; LatestRevisionDate: 17-Jul-2002; LatestRevisionNote: Re-released for DXP Platform.; Publisher: Altium Limited
D2 D3 = D Schottky: Schottky Diode; Published: 8-Jun-2000; LatestRevisionDate: 17-Jul-2002; LatestRevisionNote: Re-released for DXP Platform.; PackageReference: SMB; Publisher: Altium Limited; Code_JEDEC: DO-214-AA
D4-D7 = LED0: Typical INFRARED GaAs LED; Published: 8-Jun-2000; LatestRevisionDate: 08-Jul-2005; LatestRevisionNote: Mech Layer 1 removed.; PackageReference: LED-0; Publisher: Altium Limited
J1 = PWR2.5: Low Voltage Power Supply Connector; Published: 17-Dec-2003; DatasheetDocument: 09-May-2002; Publisher: Altium Limited; ComponentLink1Description: Manufacturer Link; ComponentLink1URL: http://domino.kycon.com/internet/Products.html
J2 U14 = Header 4: Header, 4-Pin; LatestRevisionDate: 17-Jul-2002; LatestRevisionNote: Re-released for DXP Platform.; Publisher: Altium Limited
JTAG1 = Header 10X2H: Header, 10-Pin, Dual row, Right Angle; LatestRevisionDate: 17-Jul-2002; LatestRevisionNote: Re-released for DXP Platform.; Publisher: Altium Limited
L1 L2 = INDUCTOR IRON
Q1-Q35 Q38-Q67 Q69-Q72 = 2N3904: NPN General Purpose Amplifier; Published: 8-Jun-2000; LatestRevisionDate: 15-Jan-2003; LatestRevisionNote: PCB Footprint 'BCY-W3/D4.7' replaced; DatasheetVersion: 1997; PackageVersion: Sep-1998; PackageReference: TO-92A; Publisher: Altium Limited; Code_JEDEC: TO-92A; ComponentLink1Description: Manufacturer Link; ComponentLink1URL: http://www.fairchildsemi.com/; ComponentLink2Description: Datasheet; ComponentLink2URL: http://www.fairchildsemi.com/ds/2N%2F2N3904.pdf
Q36 = MOSFET-N: N-Channel MOSFET; Published: 8-Jun-2000; LatestRevisionDate: 17-Jul-2002; LatestRevisionNote: Re-released for DXP Platform.; PackageVersion: 1995/1996; PackageReference: E3; Publisher: Altium Limited
Q37 Q68 = 2N3906: PNP General Purpose Amplifier; Published: 8-Jun-2000; LatestRevisionDate: 15-Jan-2003; LatestRevisionNote: PCB Footprint 'BCY-W3/D4.7' replaced; DatasheetVersion: 1997; PackageVersion: Sep-1998; PackageReference: TO-92A; Publisher: Altium Limited; Code_JEDEC: TO-92A; ComponentLink1Description: Manufacturer Link; ComponentLink1URL: http://www.fairchildsemi.com/; ComponentLink2Description: Datasheet; ComponentLink2URL: http://www.fairchildsemi.com/ds/2N%2F2N3906.pdf
R1-R110 = Res2: Resistor; Published: 8-Jun-2000; LatestRevisionDate: 17-Jul-2002; LatestRevisionNote: Re-released for DXP Platform.; PackageReference: AXIAL-0.4; Publisher: Altium Limited
  R2 R3 R101-R107 R110: PackageDescription: Axial Device, Thru-Hole; 2 Leads; 0.4 in Pin Spacing
S2 = SW-PB: Switch; Published: 24-Mar-1999; LatestRevisionDate: 17-Jul-2002; LatestRevisionNote: Re-released for DXP Platform.; PackageReference: SPST-2; Publisher: Altium Limited
U1 = LM2596
Y1 Y2 = XTAL: Crystal Oscillator; Published: 8-Jun-2000; LatestRevisionDate: 17-Jul-2002; LatestRevisionNote: Re-released for DXP Platform.; PackageReference: R38; Publisher: Altium Limited